# EasyEDA Pro project PCB.eprj

# Schematic Schematic1
Board Name: Board1; Create Date: 2026-05-25; Page Name: P1; Project Name: PCB; Schematic Name: Schematic1; Update Date: 2026-05-27; Company: EasyEDA.com; Page Size: A4; Version: V1.0
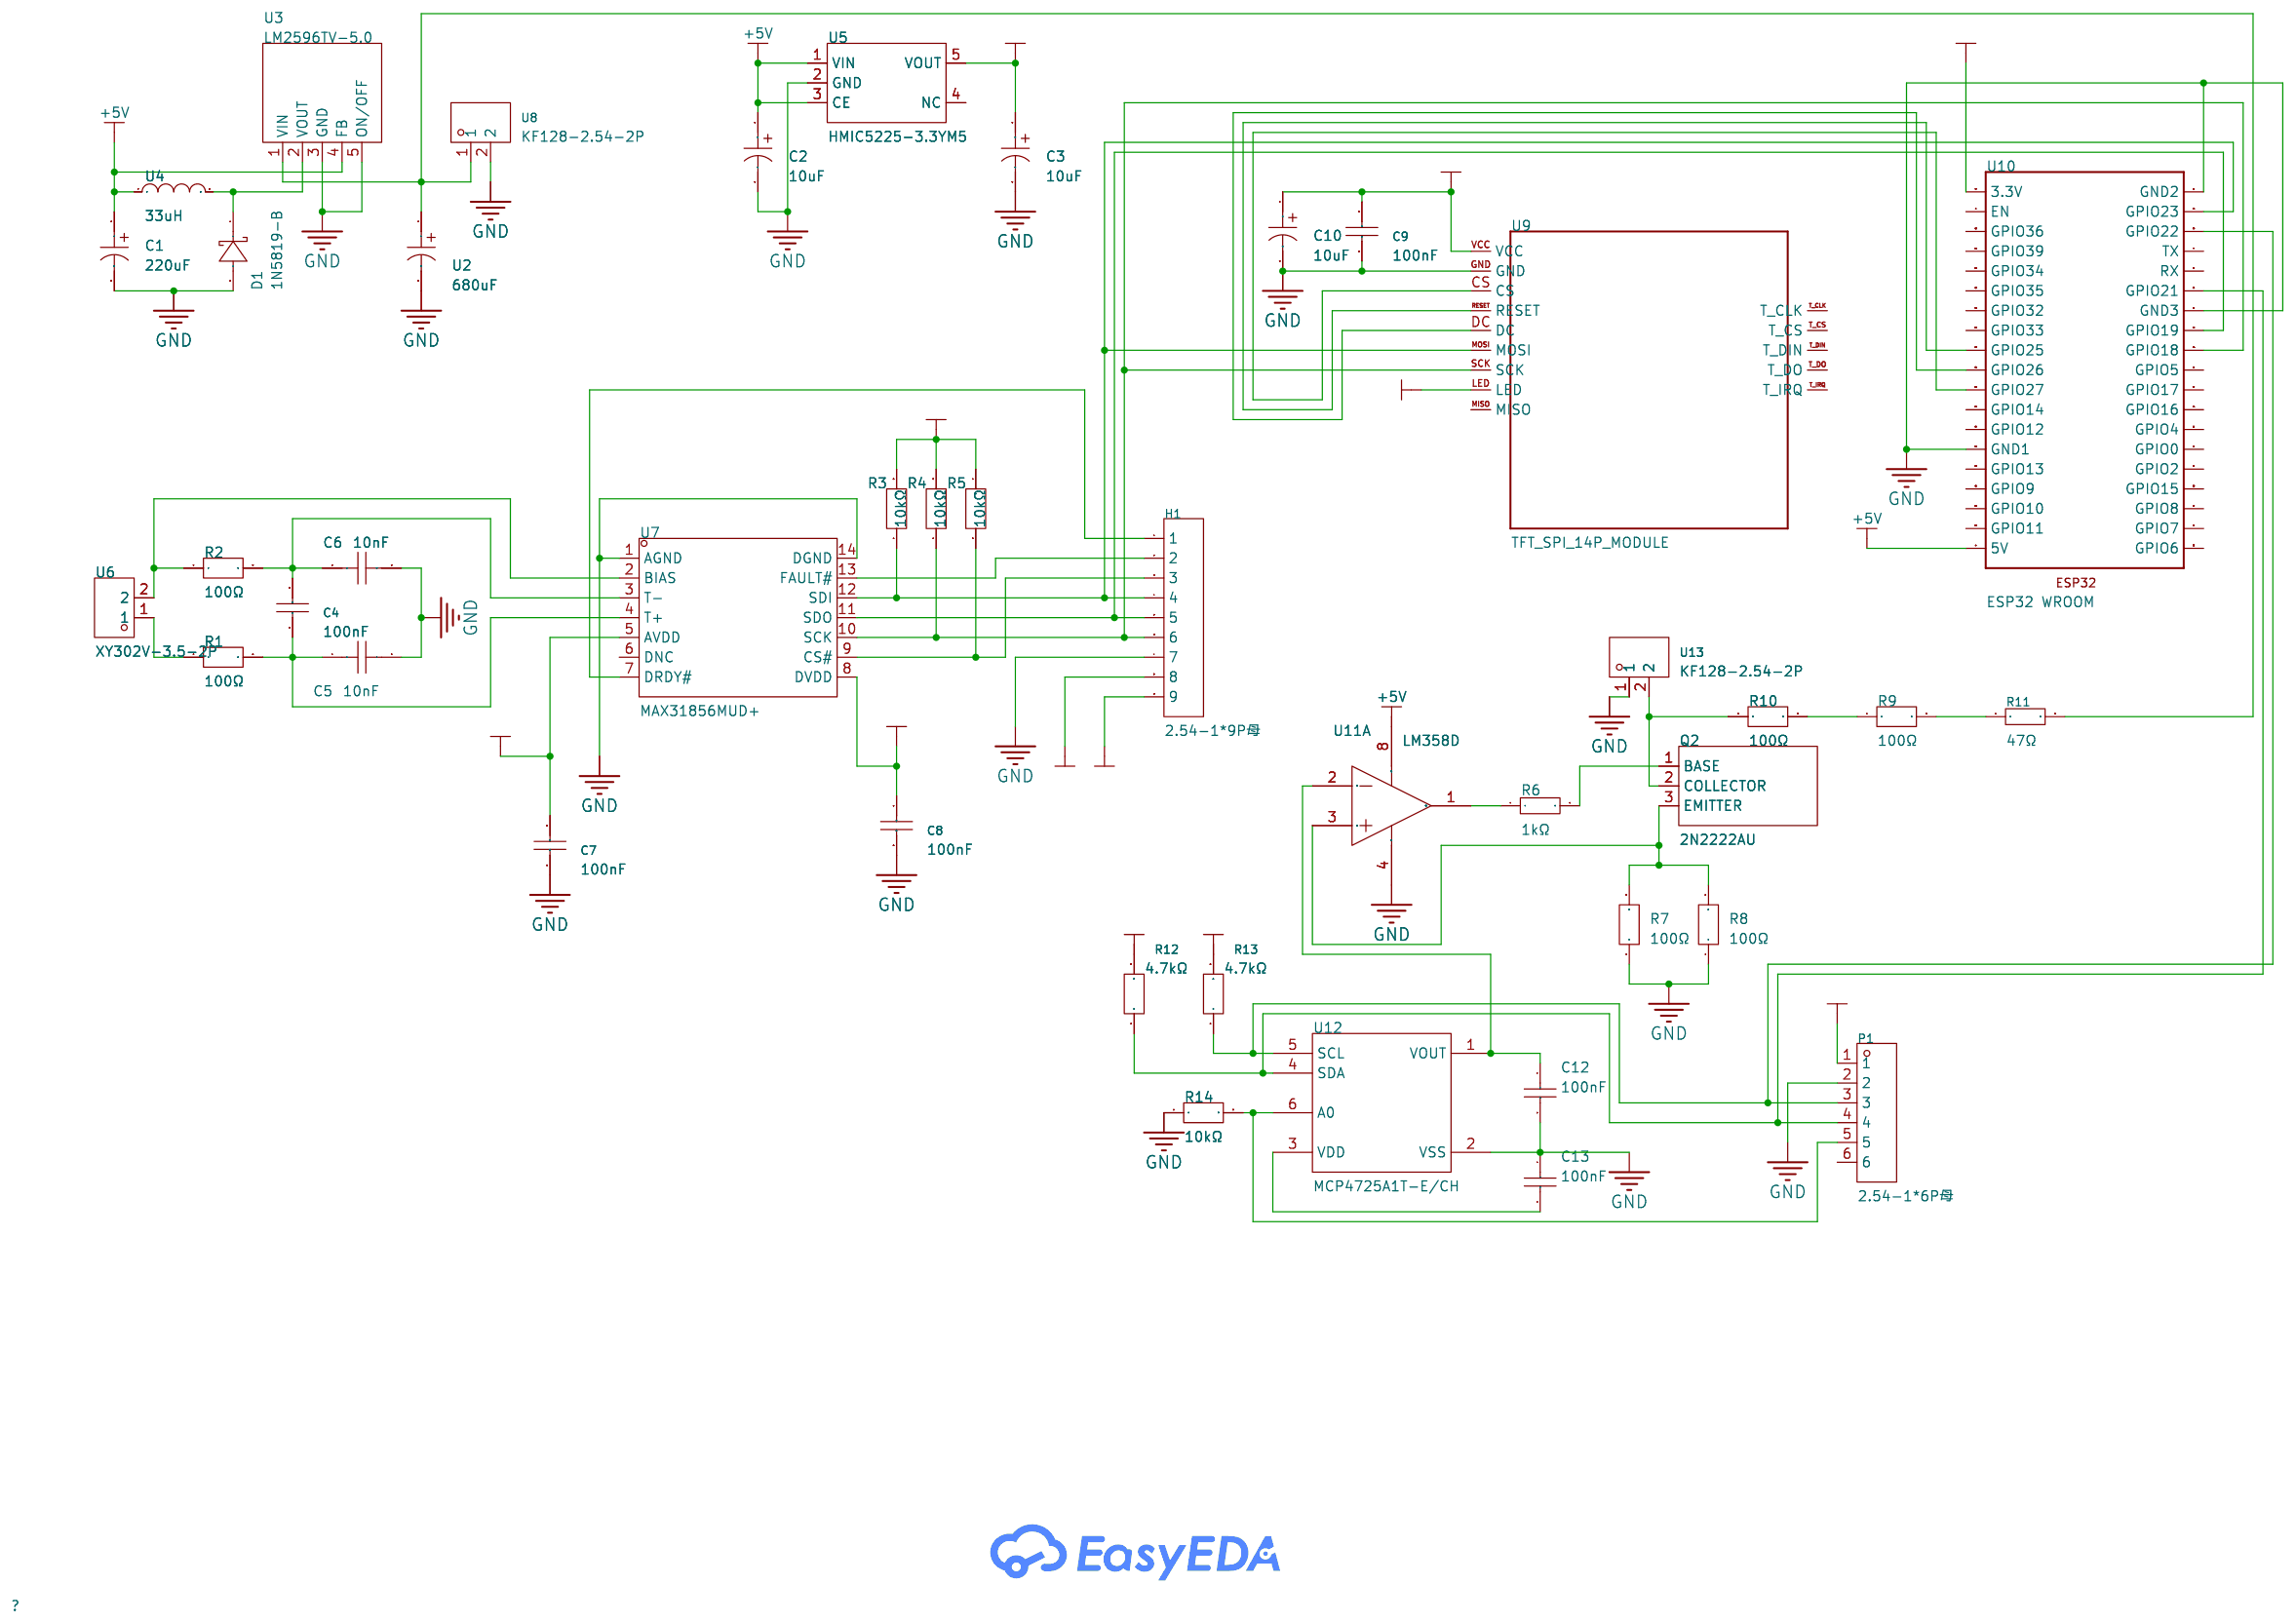
[diagram p0: schematic sheet]

## Parts
C1  220uF  [CAP-TH_BD10.0-P5.00-D1.0-FD]
C2  10uF  [CAP-TH_BD5.0-P2.00-D0.8-FD-10UF50VC110GL]
C3  10uF  [CAP-TH_BD5.0-P2.00-D0.8-FD-10UF50VC110GL]
C4  100nF  [C0805]
C5  10nF  [C0402]
C6  10nF  [C0402]
C7  100nF  [C0805]
C8  100nF  [C0805]
C9  100nF  [C0805]
C10  10uF  [CAP-TH_BD5.0-P2.00-D0.8-FD-10UF50VC110GL]
C12  100nF  [C0402]
C13  100nF  [C0402]
D1  1N5819-B  [DO-41_BD2.4-L4.7-P8.70-D0.6-RD]
H1  2.54-1*9P母  [HDR-TH_9P-P2.54-V-F-1]
P1  2.54-1*6P母  [HDR-TH_6P-P2.54-V-F]
Q2  2N2222AU  [SOT-89-3_L4.5-W2.4-P1.50-LS4.0-BR]
R1  100Ω  [R0603]
R2  100Ω  [R0603]
R3  10kΩ  [R0805]
R4  10kΩ  [R0805]
R5  10kΩ  [R0805]
R6  1kΩ  [R0402]
R7  100Ω  [R0603]
R8  100Ω  [R0603]
R9  100Ω  [R0603]
R10  100Ω  [R0603]
R11  47Ω  [R0603]
R12  4.7kΩ  [R0603]
R13  4.7kΩ  [R0603]
R14  10kΩ  [R0805]
U2  680uF  [CAP-TH_BD13.0-P5.00-D0.6-FD]
U3  LM2596TV-5.0  [TO-220-5_L10.2-W4.5-P1.70-TL]
U4  33uH  [IND-TH_L7.0-W4.0-P5.0]
U5  HMIC5225-3.3YM5  [SOT-23-5_L3.0-W1.7-P0.95-LS2.8-BL]
U6  XY302V-3.5-2P  [CONN-TH_XY302V-3.5-2P]
U7  MAX31856MUD+  [TSSOP-14_L5.0-W4.4-P0.65-LS6.4-BL]
U8  KF128-2.54-2P  [CONN-TH_P2.54_KF128-2.54-2P]
U9  TFT_SPI_14P_MODULE  [TFT_2_4_SPI_MODULE]
U10  ESP32 WROOM  [ESP32]
U11  LM358D  [SO-8_L4.9-W3.9-P1.27-LS5.9-BL]  (section 1)
U12  MCP4725A1T-E/CH  [SOT-23-6_L2.9-W1.6-P0.95-LS2.8-BR]
U13  KF128-2.54-2P  [CONN-TH_P2.54_KF128-2.54-2P]

## Library data of the parts
C1 = 220uF50V10x13GF: LCSC Part Name: 220uF ±20% 50V; Supplier Part: C49332873; Manufacturer: Econd(米朗电子); Supplier Footprint: 插件,D10xL13mm; JLCPCB Part Class: Extended Part; Datasheet: https://item.szlcsc.com/datasheet/220uF50V10x13GF/51816589.html; Supplier: LCSC; Tolerance: ±20%; Voltage Rating: 50V; Ripple Current: 850mA@100KHz; Equivalent Series Resistance(ESR): 65mΩ; Pin Spacing: 5mm; Diameter: 10mm; Height - Seated (Max): 13mm; Lifetime: 2000hrs@105℃; Operating Temperature: -40℃~+105℃
C2 C3 C10 = 10UF50VC110GL: LCSC Part Name: 10uF ±20% 50V; Supplier Part: C46867109; Manufacturer: Econd(米朗电子); Supplier Footprint: 插件,D5xL11mm; JLCPCB Part Class: Extended Part; Datasheet: https://item.szlcsc.com/datasheet/10UF50VC110GL/49031974.html; Supplier: LCSC; Tolerance: ±20%; Voltage Rating: 50V; Ripple Current: 120mA@100KHz; Equivalent Series Resistance(ESR): 1.6Ω; Pin Spacing: 2mm; Diameter: 5mm; Height - Seated (Max): 11mm; Lifetime: 5000hrs@105℃; Operating Temperature: -40℃~+105℃
C4 C7-C9 = 0805B104K500NT: LCSC Part Name: 100nF ±10% 50V; Supplier Part: C38141; Manufacturer: FH(风华); Supplier Footprint: 0805; JLCPCB Part Class: Extended Part; Datasheet: https://item.szlcsc.com/datasheet/0805B104K500NT/39123.html; Supplier: LCSC; Tolerance: ±10%; Voltage Rating: 50V; Temperature Coefficient: X7R
C5 C6 = FCC0402B103K500AT: LCSC Part Name: 10nF ±10% 50V; Supplier Part: C5137480; Manufacturer: FOJAN(富捷); Supplier Footprint: 0402; JLCPCB Part Class: Extended Part; Datasheet: https://item.szlcsc.com/datasheet/FCC0402B103K500AT/5746982.html; Supplier: LCSC; Tolerance: ±10%; Voltage Rating: 50V; Temperature Coefficient: X7R
C12 C13 = 0402B104K500NT: LCSC Part Name: 100nF ±10% 50V; Supplier Part: C110251; Manufacturer: FH(风华); Supplier Footprint: 0402; JLCPCB Part Class: Extended Part; Datasheet: https://item.szlcsc.com/datasheet/0402B104K500NT/111473.html; Supplier: LCSC; Tolerance: ±10%; Voltage Rating: 50V; Temperature Coefficient: X7R
D1 = 1N5819-B: LCSC Part Name: 电压:40V 电流:1A; Supplier Part: C908715; Manufacturer: GOODWORK(固得沃克); Supplier Footprint: DO-41; JLCPCB Part Class: Extended Part; Datasheet: https://item.szlcsc.com/datasheet/1N5819-B/975467.html; Supplier: LCSC; Diode Configuration: Independent; Voltage - Forward(Vf@If): 600mV@1A; Voltage - DC Reverse(Vr): 40V; Current - Rectified: 1A; Reverse Leakage Current (Ir): 200uA@40V; Operating Junction Temperature Range: -65℃~+125℃; Non-Repetitive Peak Forward Surge Current: 25A
H1 = 2.54-1*9P母: LCSC Part Name: 1x9P 间距:2.54mm 直插; Supplier Part: C39576; Manufacturer: BOOMELE(博穆精密); Supplier Footprint: 插件,P=2.54mm; JLCPCB Part Class: Extended Part; Datasheet: https://item.szlcsc.com/datasheet/2.54-1*9P%25E6%25AF%258D/40559.html; Supplier: LCSC; Holes Structure: 1x9P; Pitch: 2.54mm; Circular Hole / Square Hole: Square Hole; Mounting Type: Through Hole; Number of Rows: 1; Number of Positions: 9P; Current Rating: 3A; Holes Direction: Top; Contact Material: Brass; Operating Temperature: -40℃~+105℃; PIN Length: 3.3mm
P1 = 2.54-1*6P母: LCSC Part Name: 1x6P 间距:2.54mm 直插; Supplier Part: C40877; Manufacturer: BOOMELE(博穆精密); Supplier Footprint: 插件,P=2.54mm; JLCPCB Part Class: Extended Part; Datasheet: https://item.szlcsc.com/datasheet/2.54-1*6P%25E6%25AF%258D/41861.html; Supplier: LCSC; Holes Structure: 1x6P; Pitch: 2.54mm; Circular Hole / Square Hole: Square Hole; Mounting Type: Through Hole; Number of Rows: 1; Number of Positions: 6P; Current Rating: 3A; Holes Direction: Top; Contact Material: Brass; Operating Temperature: -40℃~+105℃; PIN Length: 3.3mm
Q2 = 2N2222AU: LCSC Part Name: NPN 电流:600mA 电压:40V; Supplier Part: C21714170; Manufacturer: CBI(创基); Supplier Footprint: SOT-89; JLCPCB Part Class: Extended Part; Datasheet: https://item.szlcsc.com/datasheet/2N2222AU/23141081.html; Supplier: LCSC; type: NPN; Current - Collector(Ic): 600mA; Collector - Emitter Voltage VCEO: 40V; Pd - Power Dissipation: 500mW; DC Current Gain: 300@150mA,10V; Transition frequency(fT): 300MHz; Current - Collector Cutoff: 10nA; Vce Saturation(VCE(sat)): 1V@500mA,50mA; Operating Temperature: -55℃~+150℃; Emitter-Base Voltage(Vebo): 6V; Number: 1 NPN
R1 R2 R7-R10 = FRC0603F1000TS: LCSC Part Name: 100Ω ±1% 100mW 厚膜电阻; Supplier Part: C2906981; Manufacturer: FOJAN(富捷); Supplier Footprint: 0603; JLCPCB Part Class: Extended Part; Supplier: LCSC; Type: Thick Film Resistor; Tolerance: ±1%; Power(Watts): 100mW; Voltage-Supply(Max): 75V; Temperature Coefficient: ±100ppm/℃; Operating Temperature: -55℃~+155℃
R3-R5 R14 = FRC0805J103TS: LCSC Part Name: 10kΩ ±5% 125mW 厚膜电阻; Supplier Part: C2930231; Manufacturer: FOJAN(富捷); Supplier Footprint: 0805; JLCPCB Part Class: Extended Part; Supplier: LCSC; Type: Thick Film Resistor; Tolerance: ±5%; Power(Watts): 125mW; Voltage-Supply(Max): 150V; Temperature Coefficient: ±100ppm/℃; Operating Temperature: -55℃~+155℃
R6 = RC0402FR-071KL: LCSC Part Name: 厚膜电阻 1kΩ ±1% 62.5mW; Supplier Part: C106235; Manufacturer: YAGEO(国巨); Supplier Footprint: 0402; JLCPCB Part Class: Extended Part; Datasheet: https://item.szlcsc.com/datasheet/RC0402FR-071KL/107450.html; Supplier: LCSC; Type: Thick Film Resistor; Tolerance: ±1%; Power(Watts): 62.5mW; Voltage-Supply(Max): 50V; Temperature Coefficient: ±100ppm/℃; Operating Temperature: -55℃~+155℃
R11 = 0603WAF470JT5E: LCSC Part Name: 47Ω ±1% 100mW 厚膜电阻; Supplier Part: C23182; Manufacturer: UNI-ROYAL(厚声); Supplier Footprint: 0603; JLCPCB Part Class: Basic Part; Datasheet: https://item.szlcsc.com/datasheet/0603WAF470JT5E/23909.html; Supplier: LCSC; Type: Thick Film Resistor; Tolerance: ±1%; Power(Watts): 100mW; Voltage-Supply(Max): 75V; Temperature Coefficient: ±100ppm/℃; Operating Temperature: -55℃~+155℃
R12 R13 = FRC0603J472 TS: LCSC Part Name: 4.7kΩ ±5% 100mW 厚膜电阻; Supplier Part: C2907166; Manufacturer: FOJAN(富捷); Supplier Footprint: 0603; JLCPCB Part Class: Extended Part; Supplier: LCSC; Type: Thick Film Resistor; Tolerance: ±5%; Power(Watts): 100mW; Voltage-Supply(Max): 75V; Temperature Coefficient: ±100ppm/℃; Operating Temperature: -55℃~+155℃
U2 = SHF680UF50V03EC1055: LCSC Part Name: 680uF ±20% 50V; Supplier Part: C2981468; Manufacturer: KNSCHA(科尼盛); Supplier Footprint: 插件,D13xL17mm; JLCPCB Part Class: Extended Part; Datasheet: https://item.szlcsc.com/datasheet/SHF680UF50V03EC1055/3408690.html; Supplier: LCSC; Tolerance: ±20%; Voltage Rating: 50V; Ripple Current: 1.1A@100kHz; Equivalent Series Resistance(ESR): 55mΩ@100kHz; Pin Spacing: 5mm; Diameter: 13mm; Height - Seated (Max): 17mm; Lifetime: 5000hrs@105℃; Operating Temperature: -40℃~+105℃
U3 = LM2596TV-5.0: LCSC Part Name: 降压型 3A 40V; Supplier Part: C32381516; Manufacturer: HTC; Supplier Footprint: TO-220TV-5L; JLCPCB Part Class: Extended Part; Datasheet: https://item.szlcsc.com/datasheet/LM2596TV-5.0/34114759.html; Supplier: LCSC; Function: Buck; Voltage - Supply: 40V; Output Voltage: 5V; Output Current: 3A; Frequency - Switching: 150kHz; Operating Temperature: -40℃~+125℃; Synchronous Rectifier: No; Number of Outputs: 1; Topology: Buck; Quiescent Current: 5mA; Switch tube (built-in/external): Built-in; Output Type: Fixed
U4 = 2727-07H: LCSC Part Name: 33uH ±3%; Supplier Part: C17574802; Manufacturer: API Delevan; Supplier Footprint: 插件,7.1x4.1mm; JLCPCB Part Class: Extended Part; Supplier: LCSC; Tolerance: ±3%
U5 = HMIC5225-3.3YM5: LCSC Part Name: IO:0.15A VO:3.3V VI:18V; Supplier Part: C22392690; Manufacturer: HXY MOSFET(华轩阳电子); Supplier Footprint: SOT-23-5L; JLCPCB Part Class: Extended Part; Datasheet: https://item.szlcsc.com/datasheet/HMIC5225-3.3YM5/23981531.html; Supplier: LCSC; Output Type: Fixed; Voltage - Supply: 16V; Output Voltage: 3.3V; Output Current: 150mA; Voltage Dropout: 25mV@(1mA); standby current: 5uA; Features: Enable；Over Current Protection；Over Temperature Protection; Operating Temperature: -30℃~+85℃@(Ta); Output Configuration: Positive; Number of Outputs: 1
U6 = XY302V-3.5-2P: LCSC Part Name: 1x2P 3.5mm 直插 排数:1 每排P数:2; Supplier Part: C784940; Manufacturer: XINLAIYA(新莱亚); Supplier Footprint: 插件,P=3.5mm; JLCPCB Part Class: Extended Part; Datasheet: https://atta.szlcsc.com/upload/public/pdf/source/20200917/C784940_49AA76C88E0E78B736F07A335BB5A9B8.pdf; Supplier: LCSC; Structure: 1x2P; Pitch: 3.5mm; Color: Green; Mounting Style: Straight; Current Rating (Max): 10A; Voltage Rating (Max): 150V; Number of Pins: 2P; Number of Rows: 1; Wire Gauge - AWG: 16~26; Wire Gauge - mm2: 1; Number of PINs Per Row: 2; Contact Material: Copper; Contact Plating: Tin; Screw Specification: M2
U7 = MAX31856MUD+: LCSC Part Name: MAX31856MUD; Supplier Part: C116632; Manufacturer: ADI(亚德诺)/MAXIM(美信); Supplier Footprint: TSSOP-14; JLCPCB Part Class: Extended Part; Datasheet: https://atta.szlcsc.com/upload/public/pdf/source/20180413/C116632_831D9B1C9ECFD227FC0EF5729DAE9663.pdf; Supplier: LCSC
U8 U13 = KF128-2.54-2P: LCSC Part Name: 2.54mm 1x2P 排数:1 每排P数:2 直插; Supplier Part: C474920; Manufacturer: KEFA(科发); Supplier Footprint: 插件,P=2.54mm; JLCPCB Part Class: Extended Part; Datasheet: https://atta.szlcsc.com/upload/public/pdf/source/20230317/0E5ECA9DB49110BC3219D12632CEA6EE.pdf; Supplier: LCSC; Structure: 1x2P; Pitch: 2.54mm; Color: Green; Mounting Style: Straight; Current Rating (Max): 8A; Voltage Rating (Max): 130V; Number of Pins: 2P; Number of Rows: 1; Wire Gauge - AWG: 18~26; Wire Gauge - mm2: 1; Number of PINs Per Row: 2; Operating Temperature Range: -40℃~+105℃
U9 = TFT_SPI_14P_MODULE
U10 = ESP32
U11 = LM358D: LCSC Part Name: 低功耗双运算放大器，低输入偏置电流; Supplier Part: C2936099; Manufacturer: ST(意法半导体); Supplier Footprint: SO-8; JLCPCB Part Class: Extended Part; Datasheet: https://item.szlcsc.com/datasheet/LM358D/3287847.html; Supplier: LCSC; Number of Channels: 2; Maximum Power Supply Range (Vdd-Vss): 32V; Gain Bandwidth Product: 1.1MHz; Vos - Input Offset Voltage: 7mV; Input Offset Voltage Drift(Vos TC): 30uV/℃; Slew Rate: 600V/ms; Ib - Input Bias Current: 200nA; Input Offset Current(Ios): 30nA; Noise density(eN): 55nV/√Hz@1kHz; Common Mode Rejection Ratio(CMRR): 85dB; Input offset current drift(Ios TC): 300pA/℃; Quiescent Current: 1.2mA; Operating Temperature: 0℃~+70℃; Single supply: 3V~30V
U12 = MCP4725A1T-E/CH: LCSC Part Name: 12-位数字到模拟转换器带EEPROM内存，采用SOT-23-6封装; Supplier Part: C61423; Manufacturer: MICROCHIP(美国微芯); Supplier Footprint: SOT-23-6; JLCPCB Part Class: Extended Part; Datasheet: https://item.szlcsc.com/datasheet/MCP4725A1T-E%252FCH/62476.html; Supplier: LCSC; Resolution(Bits): 12; Number of Channels: 1; Interface: I2C; Voltage - Supply: 2.7V~5.5V; Settling Time: 6us; Output Type: Voltage Buffer; Integral non - linearity: 2LSB; Operating Temperature: -40℃~+125℃; Power-On Reset: Built-in; Voltage Reference: External; Data rate: 3.4MHz；100kHz；400kHz; Quiescent Current (Iq): 60nA

## Nets
+3.3V: C3.1 C7.1 C8.1 C9.1 C10.1 H1.8 P1.1 R3.2 R4.2 R5.1 R12.2 R13.2 U5.5(VOUT) U7.5(AVDD) U7.8(DVDD) U9.LED U9.VCC U10.3.3V
+5V: C1.1 C2.1 U3.4(FB) U4.1 U5.1(VIN) U5.3(CE) U10.5V U11.8(VCC+)
GND: C1.2 C2.2 C3.2 C5.2 C6.2 C7.2 C8.2 C9.2 C10.2 C12.2 C13.1 D1.2(A) H1.7 P1.2 R7.1 R8.1 R14.1 U2.2 U3.3(GND) U3.5(ON/OFF) U5.2(GND) U7.1(AGND) U7.14(DGND) U8.2 U9.GND U10.GND1 U10.GND2 U10.GND3 U11.4(VCC-) U12.2(VSS) U13.1
VIN: H1.9
$1N404: R11.2 U2.1 U3.1(VIN) U8.1
$1N698: D1.1(K) U3.2(VOUT) U4.2
$1N1786: R2.1 U6.2 U7.2(BIAS)
$1N1792: C4.1 C5.1 R1.2 U7.4(T+)
$1N2031: C4.2 C6.1 R2.2 U7.3(T-)
$1N3106: H1.2 U7.13(FAULT#)
$1N3112: H1.4 R3.1 U7.12(SDI) U9.MOSI U10.GPIO23
$1N3116: H1.5 U7.11(SDO) U10.GPIO19
$1N3121: H1.6 R4.1 U7.10(SCK) U9.SCK U10.GPIO18
$1N3126: H1.3 R5.2 U7.9(CS#)
$1N5751: U9.CS U10.GPIO27
$1N5766: U9.RESET U10.GPIO25
$1N5777: U9.DC U10.GPIO26
$1N6508: R6.1 U11.1(OUT1)
$1N6563: Q2.3(EMITTER) R7.2 R8.2 U11.3(IN1+)
$1N6609: Q2.2(COLLECTOR) R10.1 U13.2
$1N6614: R9.1 R10.2
$1N6619: R9.2 R11.1
$1N7236: P1.3 R13.1 U10.GPIO22 U12.5(SCL)
$1N7241: P1.4 R12.1 U10.GPIO21 U12.4(SDA)
$1N7320: P1.5 R14.2 U12.6(A0)
$1N7324: C13.2 U12.3(VDD)
$1N7489: C12.1 U11.2(IN1-) U12.1(VOUT)
$1N7539: H1.1 U7.7(DRDY#)
$1N8835: R1.1 U6.1
$1N10153: Q2.1(BASE) R6.2

Not connected (* = marked no-connect by the designer): P1 6; U5 4(NC); U7 6(DNC); U9 MISO T_CLK T_CS T_DIN T_DO T_IRQ; U10 EN GPIO0 GPIO2 GPIO4 GPIO5 GPIO6 GPIO7 GPIO8 GPIO9 GPIO10 GPIO11 GPIO12 GPIO13 GPIO14 GPIO15 GPIO16 GPIO17 GPIO32 GPIO33 GPIO34 GPIO35 GPIO36 GPIO39 RX TX

# Board PCB1
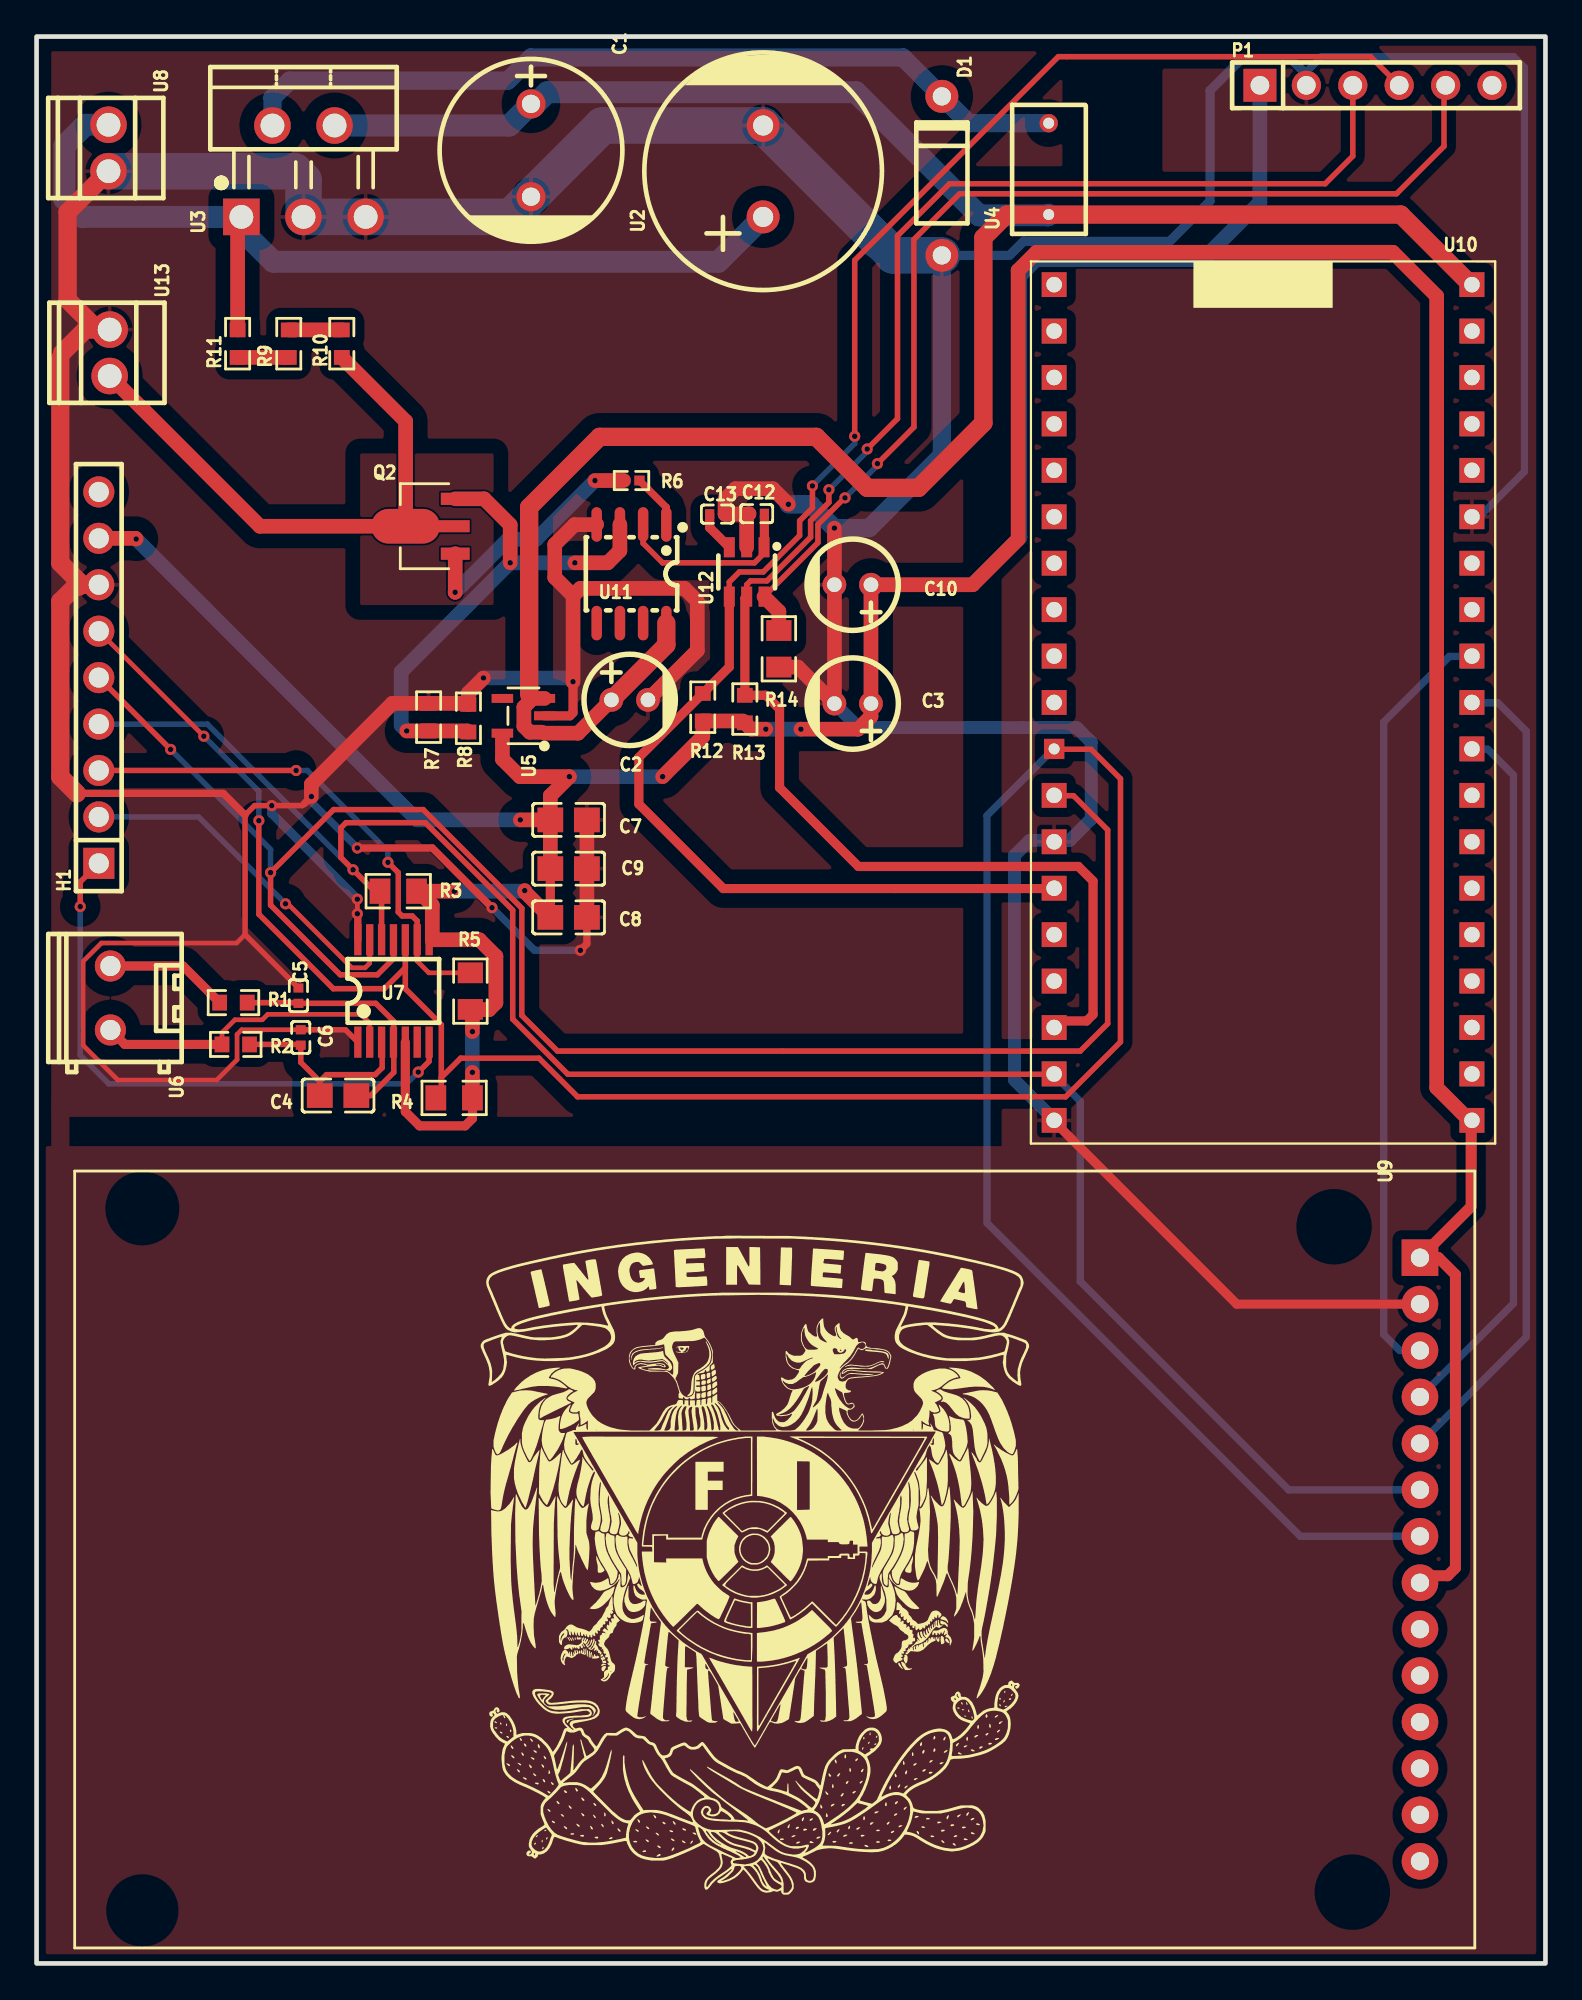
[diagram p1: board, top side]
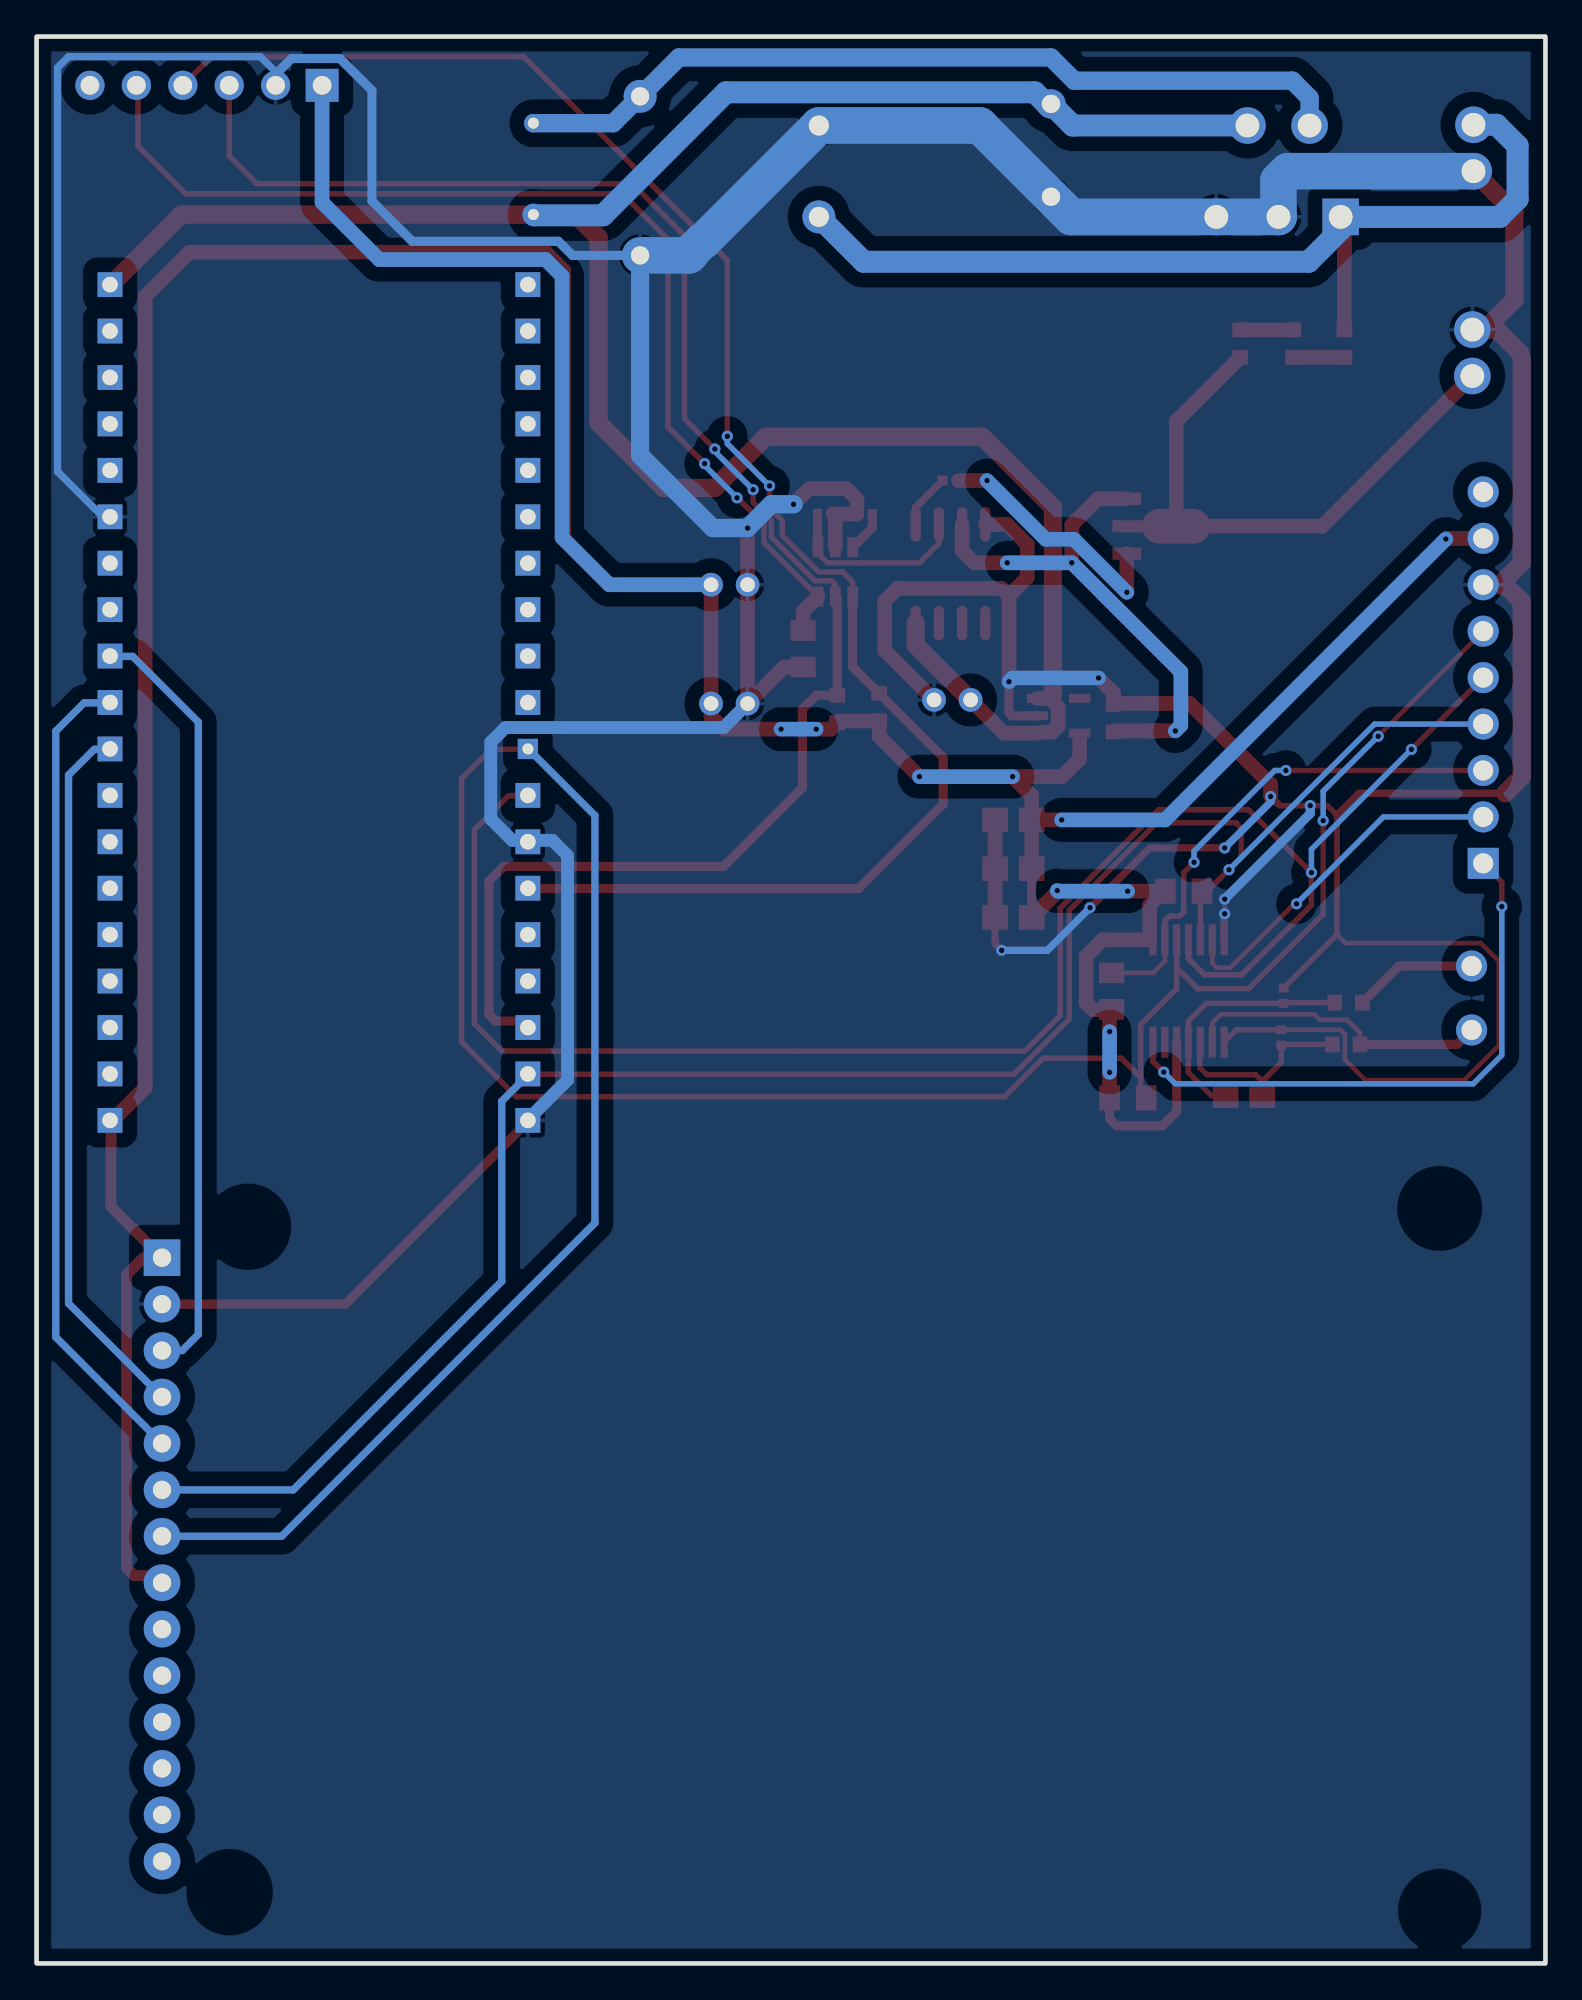
[diagram p2: board, bottom side, seen from below]

Outline 82.55 x 105.41 mm; copper layers: Top Layer, Bottom Layer. Coordinates in mm from the lower left corner of the outline.
Outline path: rectangle 0,105.41 82.55,0
Stack: Top Layer 0.035mm / Dielectric1 1.51mm FR4 er 4.5 / Bottom Layer 0.035mm

## Design rules (mm)
template: Custom Config
spacing copperThickness1oz (default): track to track 0.102, other pairs 0.152 to 0.3
spacing copperThickness2oz: track to track 0.203, other pairs 0.152 to 0.3
track width copperThickness1oz (default): min 0.127, default 0.254, max 2.54
track width copperThickness2oz: min 0.203, default 0.254, max 2.54
differential pair differentialPair (default): width min 0.127, default 0.254, max 2.54; gap min 0.152, default 0.152
via viaSize (default): diameter min 0.5, default 0.61, max 10; hole min 0.3, default 0.305, max 6.3
net GND uses copperRegion1
net $1N6609 uses copperRegion1

## Placement (name value [footprint] x y rotation side)
C1  220uF  [CAP-TH_BD10.0-P5.00-D1.0-FD]  27.05 99.19 270 top
C2  10uF  [CAP-TH_BD5.0-P2.00-D0.8-FD-10UF50VC110GL]  32.45 69.12 0 top
C3  10uF  [CAP-TH_BD5.0-P2.00-D0.8-FD-10UF50VC110GL]  44.65 68.92 180 top
C4  100nF  [C0805]  16.49 47.48 180 top
C5  10nF  [C0402]  14.33 52.94 90 top
C6  10nF  [C0402]  14.45 50.66 90 top
C7  100nF  [C0805]  29.11 62.56 0 top
C8  100nF  [C0805]  29.11 57.22 0 top
C9  100nF  [C0805]  29.11 59.89 0 top
C10  10uF  [CAP-TH_BD5.0-P2.00-D0.8-FD-10UF50VC110GL]  44.65 75.42 180 top
C12  100nF  [C0402]  39.4 79.31 180 top
C13  100nF  [C0402]  37.25 79.29 180 top
D1  1N5819-B  [DO-41_BD2.4-L4.7-P8.70-D0.6-RD]  49.53 97.79 270 top
H1  2.54-1*9P母  [HDR-TH_9P-P2.54-V-F-1]  3.41 70.34 90 top
P1  2.54-1*6P母  [HDR-TH_6P-P2.54-V-F]  73.28 102.74 0 top
Q2  2N2222AU  [SOT-89-3_L4.5-W2.4-P1.50-LS4.0-BR]  21.55 78.62 0 top
R1  100Ω  [R0603]  10.77 52.56 0 top
R2  100Ω  [R0603]  10.9 50.27 0 top
R3  10kΩ  [R0805]  19.79 58.66 0 top
R4  10kΩ  [R0805]  22.84 47.35 0 top
R5  10kΩ  [R0805]  23.73 53.19 90 top
R6  1kΩ  [R0402]  32.55 81.12 180 top
R7  100Ω  [R0603]  21.45 68.18 270 top
R8  100Ω  [R0603]  23.63 68.12 270 top
R9  100Ω  [R0603]  13.8 88.61 270 top
R10  100Ω  [R0603]  16.7 88.61 90 top
R11  47Ω  [R0603]  11 88.61 90 top
R12  4.7kΩ  [R0603]  36.45 68.72 270 top
R13  4.7kΩ  [R0603]  38.75 68.62 270 top
R14  10kΩ  [R0805]  40.61 71.92 90 top
U2  680uF  [CAP-TH_BD13.0-P5.00-D0.6-FD]  39.75 98.04 90 top
U3  LM2596TV-5.0  [TO-220-5_L10.2-W4.5-P1.70-TL]  14.61 98.04 90 top
U4  33uH  [IND-TH_L7.0-W4.0-P5.0]  55.37 98.17 90 top
U5  HMIC5225-3.3YM5  [SOT-23-5_L3.0-W1.7-P0.95-LS2.8-BL]  26.64 68.25 90 top
U6  XY302V-3.5-2P  [CONN-TH_XY302V-3.5-2P]  4.04 52.81 270 top
U7  MAX31856MUD+  [TSSOP-14_L5.0-W4.4-P0.65-LS6.4-BL]  19.53 53.2 0 top
U8  KF128-2.54-2P  [CONN-TH_P2.54_KF128-2.54-2P]  3.94 99.31 270 top
U9  TFT_SPI_14P_MODULE  [TFT_2_4_SPI_MODULE]  40.39 22.1 270 top
U10  ESP32 WROOM  [ESP32]  79.8 93.11 180 top
U11  LM358D  [SO-8_L4.9-W3.9-P1.27-LS5.9-BL]  32.55 76.02 180 top
U12  MCP4725A1T-E/CH  [SOT-23-6_L2.9-W1.6-P0.95-LS2.8-BR]  38.85 76.12 90 top
U13  KF128-2.54-2P  [CONN-TH_P2.54_KF128-2.54-2P]  4 88.11 270 top

## Footprints (pads in the part's own frame, mm; a bottom-side part is the same pattern mirrored in y, then rotated)
C0402
  rect 0.5x0.54 smd: 1(-0.42,0) 2(0.42,0)
C0805
  rect 1.41x1.35 smd: 1(-1,0) 2(1,0)
CAP-TH_BD5.0-P2.00-D0.8-FD-10UF50VC110GL
  round 1.3 hole 0.8: 1(-1,0) 2(1,0)
CAP-TH_BD10.0-P5.00-D1.0-FD
  round 1.6 hole 1: 1(-2.54,0) 2(2.54,0)
CAP-TH_BD13.0-P5.00-D0.6-FD
  round 1.8 hole 1.1: 1(-2.5,0) 2(2.5,0)
CONN-TH_P2.54_KF128-2.54-2P
  round 2 hole 1.3: 1(-1.27,0) 2(1.27,0)
CONN-TH_XY302V-3.5-2P
  round 1.7 hole 1.1: 1(-1.75,0) 2(1.75,0)
DO-41_BD2.4-L4.7-P8.70-D0.6-RD
  round 1.8 hole 1: 1(-4.35,0) 2(4.35,0)
ESP32
  rect 1.358x1.358 hole 0.85: 3.3V(1.27,46.99) 5V(1.27,1.27) EN(1.27,44.45) GND1(1.27,13.97) GND2(24.13,46.99) GND3(24.13,31.75) GPIO0(24.13,13.97) GPIO2(24.13,11.43) GPIO4(24.13,16.51) GPIO5(24.13,24.13) GPIO6(24.13,1.27) GPIO7(24.13,3.81) GPIO8(24.13,6.35) GPIO9(1.27,8.89) GPIO10(1.27,6.35) GPIO11(1.27,3.81) GPIO12(1.27,16.51) GPIO13(1.27,11.43) GPIO14(1.27,19.05) GPIO15(24.13,8.89) GPIO16(24.13,19.05) GPIO17(24.13,21.59) GPIO19(24.13,29.21) GPIO21(24.13,34.29) GPIO22(24.13,41.91) GPIO23(24.13,44.45) GPIO25(1.27,26.67) GPIO26(1.27,24.13) GPIO27(1.27,21.59) GPIO32(1.27,31.75) GPIO33(1.27,29.21) GPIO34(1.27,36.83) GPIO35(1.27,34.29) GPIO36(1.27,41.91) GPIO39(1.27,39.37) RX(24.13,36.83) TX(24.13,39.37)
  rect 1.108x1.108 hole 0.6: GPIO18(24.13,26.67)
HDR-TH_6P-P2.54-V-F
  rect 1.8x1.8 hole 1.02: 1(-6.35,0)
  round 1.6 hole 1.02: 2(-3.81,0) 3(-1.27,0) 4(1.27,0) 5(3.81,0) 6(6.35,0)
HDR-TH_9P-P2.54-V-F-1
  rect 1.7x1.7 hole 1.1: 1(-10.16,0)
  round 1.7 hole 1.1: 2(-7.62,0) 3(-5.08,0) 4(-2.54,0) 5(0,0) 6(2.54,0) 7(5.08,0) 8(7.62,0) 9(10.16,0)
IND-TH_L7.0-W4.0-P5.0
  round 1 hole 0.6: 1(-2.5,0) 2(2.5,0)
R0402
  rect 0.566x0.54 smd: 1(-0.433,0) 2(0.433,0)
R0603
  rect 0.806x0.864 smd: 1(-0.753,0) 2(0.753,0)
R0805
  rect 1.133x1.377 smd: 1(-1,0) 2(1,0)
SO-8_L4.9-W3.9-P1.27-LS5.9-BL
  oval 0.574x1.888 smd: 1(-1.905,-2.699) 2(-0.635,-2.699) 3(0.635,-2.699) 4(1.905,-2.699) 5(1.905,2.699) 6(0.635,2.699) 7(-0.635,2.699) 8(-1.905,2.699)
SOT-23-5_L3.0-W1.7-P0.95-LS2.8-BL
  rect 0.49x1.157 smd: 1(-0.95,-1.153) 2(0,-1.153) 3(0.95,-1.153)
  rect 0.49x1.175 smd: 4(0.95,1.153) 5(-0.95,1.153)
SOT-23-6_L2.9-W1.6-P0.95-LS2.8-BR
  rect 1.1x0.6 smd: 1(1.35,-0.95) 2(1.35,0) 3(1.35,0.95) 4(-1.35,0.95) 5(-1.35,0) 6(-1.35,-0.95)
SOT-89-3_L4.5-W2.4-P1.50-LS4.0-BR
  rect 1.575x0.672 smd: 1(1.357,-1.5) 3(1.357,1.5)
  custom 5.377x1.9 smd: 2(-1.357,-0.001)
TFT_2_4_SPI_MODULE
  round 2 hole 1: CS(-11.43,35.3) DC(-6.35,35.3) GND(-13.97,35.3) LED(1.27,35.3) MISO(3.81,35.3) MOSI(-3.81,35.3) RESET(-8.89,35.3) SCK(-1.27,35.3) T_CLK(6.35,35.3) T_CS(8.89,35.3) T_DIN(11.43,35.3) T_DO(13.97,35.3) T_IRQ(16.51,35.3)
  rect 2x2 hole 1: VCC(-16.51,35.3)
TO-220-5_L10.2-W4.5-P1.70-TL
  rect 2x2 hole 1.3: 1(-2.5,3.4)
  round 2 hole 1.3: 2(2.5,1.7) 3(-2.5,0) 4(2.5,-1.7) 5(-2.5,-3.4)
TSSOP-14_L5.0-W4.4-P0.65-LS6.4-BL
  rect 0.4x1.7 smd: 1(-1.95,-2.8) 2(-1.3,-2.8) 3(-0.65,-2.8) 4(0,-2.8) 5(0.65,-2.8) 6(1.3,-2.8) 7(1.95,-2.8) 8(1.95,2.8) 9(1.3,2.8) 10(0.65,2.8) 11(0,2.8) 12(-0.65,2.8) 13(-1.3,2.8) 14(-1.95,2.8)

## Nets
As in the schematic.

Pads without a net: P1 6; U5 4; U7 6; U9 MISO T_CLK T_CS T_DIN T_DO T_IRQ; U10 EN GPIO0 GPIO2 GPIO4 GPIO5 GPIO6 GPIO7 GPIO8 GPIO9 GPIO10 GPIO11 GPIO12 GPIO13 GPIO14 GPIO15 GPIO16 GPIO17 GPIO32 GPIO33 GPIO34 GPIO35 GPIO36 GPIO39 RX TX; U11 5 6 7

## Via types
v1: diameter 0.61, hole 0.305, Top Layer to Bottom Layer, 42 vias

## Routing (per net, layer and track width the routed paths; a pad name or vN(x,y) marks a point on that pad's centre or on a via; arc(x,y) is an arc through that point)
+3.3V: length 270.8
  Top Layer w0.5: U7.5 20.18,46.6 20.95,45.82 23.45,45.82 23.85,46.22 23.85,47.34 R4.2 ; C8.1 C9.1
  Top Layer w0.6: 78.49,46.1 78.49,41.41 U9.VCC 76.7,38.61 77.62,37.69 77.62,21.63 77.2,21.21 76.07,21.21 U9.LED
  Top Layer w0.8: H1.8 5.41,77.96 v1(5.45,77.92) ; v1(41.82,67.52) 44.95,67.52 45.65,68.22 C3.1 45.65,75.12 ; v1(23.84,50.98) 23.84,52.08 23.75,52.18 24.75,52.18 25.13,52.56 25.13,55.1 24.23,56 21.65,56 21.65,57.9 20.89,58.66 ; 20.89,58.66 R3.2 ; 20.89,58.66 v1(22.86,58.66) ; C9.1 C7.1 ; C7.1 28.11,63.88 v1(29.15,64.92) 26.45,64.92 25.49,65.89 25.49,67.02 ; C7.1 v1(26.47,62.56) ; 38.65,67.97 R12.2 36.45,67.12 v1(34.25,64.92) ; C8.1 26.71,58.62 v1(26.71,58.69) ; 78.49,46.1 78.41,46.1 76.6,47.91 76.6,91.21 74.2,93.61 54.7,93.61 53.7,92.61 53.7,77.91 51.21,75.42 C10.1 ; v1(39.9,67.52) 39.1,67.52 R13.2 ; R4.2 v1(23.84,48.75)
  Bottom Layer w0.8: v1(39.9,67.52) v1(41.82,67.52) ; v1(26.47,62.56) 20.81,62.56 v1(5.45,77.92) ; v1(23.84,48.75) v1(23.84,50.98) ; C10.1 51.21,75.42 53.8,78.01 53.8,92.31 54.7,93.21 63.8,93.21 66.93,96.34 P1.1 ; v1(22.86,58.66) 26.67,58.66 v1(26.71,58.69) ; v1(29.15,64.92) v1(34.25,64.92)
+5V: length 134.7
  Top Layer w0.5: 27.69,67.3 27.64,67.35
  Top Layer w0.8: C2.1 29.63,67.3 U5.1 ; 27.64,67.35 26.99,67.35 26.66,67.68 26.66,68.73 26.95,69.01 26.95,69.42 27.17,69.2 U5.3
  Top Layer w1: 78.49,91.82 74.64,95.67 U4.1 53.06,95.67 51.8,94.41 51.8,84.27 48.25,80.72 45.45,80.72 42.66,83.51 30.8,83.51 26.95,79.66 26.95,69.42 ; U11.8 34.45,72.13 C2.1
  Bottom Layer w1.2: U4.1 55.33,95.63 51.56,95.63 44.83,102.36 27.94,102.36 27.31,101.73 C1.1 25.87,100.54 U3.4
GND: length 403.5
  Top Layer w0.254: 11.41,56.28 10.94,55.82 3.55,55.82 2.55,54.82 2.55,50.22 4.45,48.32 9.85,48.32 10.97,49.44 10.97,50.82 11.22,51.08 C6.2 ; v1(17.55,58.22) v1(17.55,57.42)
  Top Layer w0.3: C6.2 16.9,51.08 U7.1 ; 14.64,63.44 14.54,63.34 v1(12.87,63.34) 11.93,63.34 11.41,62.82 11.41,56.28 C5.2
  Top Layer w0.4: 11.41,62.82 10.21,64.01 2.5,64.01 ; U7.14 17.58,57.39 v1(17.55,57.42) ; v1(24.92,57.75) 21.65,61.02 v1(17.55,61.02) ; C8.2 30.11,55.78 v1(29.75,55.42) ; v1(15.04,63.84) 14.64,63.44
  Top Layer w0.5: U5.2 29.18,68.25 29.35,68.42 v1(29.35,70.12) ; 55.63,46.1 65.66,36.07 U9.GND
  Top Layer w0.8: U11.4 30.58,78.72 30.57,78.71 29.44,78.71 28.35,77.62 28.35,75.82 29.35,74.82 ; 29.35,74.82 29.75,75.22 35.45,75.22 36.15,74.52 36.15,71.82 C2.2 ; 29.35,74.82 v1(29.35,70.12) ; 38.96,79.29 C12.2 ; 38.96,79.29 38.85,79.18 U12.2 ; 38.96,79.29 C13.1 37.67,80.11 38.23,80.68 40.28,80.68 v1(41.13,79.82) ; C7.2 C9.2 C8.2 ; v1(43.65,78.52) C10.2 C3.2 41.65,70.92 R14.1 ; v1(15.04,63.84) 15.04,64.51 19.46,68.93 R7.1 23.57,68.93 R8.1 23.63,69.5 v1(24.45,70.32)
  Top Layer w1: 2.3,75.31 2.1,75.31 1.3,74.51 1.3,64.91 2.2,64.01 ; 1.4,88.11 2.67,89.38 3.33,89.38 ; 3.33,89.38 U13.1 ; 3.33,89.38 1.7,91.01 1.7,95.81 U8.2 ; H1.7 2.49,75.42 1.3,76.61 1.3,87.81
  Bottom Layer w0.4: v1(29.75,55.42) 27.25,55.42 v1(24.92,57.75) ; 69.47,103.34 69.47,103.48 70.3,104.31 80.8,104.31 81.4,103.71 81.4,81.61 78.91,79.12 78.49,79.12 ; v1(17.55,61.02) 15.01,63.56 15.01,63.81
  Bottom Layer w0.5: v1(12.87,63.34) 12.87,62.9 v1(17.55,58.22) ; D1.2 53.23,93.44 54,94.21 62,94.21 64.2,96.41 64.2,102.46 65.95,104.21 68.6,104.21 69.47,103.34 P1.2
  Bottom Layer w0.7: C3.2 44.96,67.61 56.9,67.61 57.7,66.81 57.7,62.61 56.53,61.44 54.33,61.44 53.5,60.61 53.5,48.33 55.63,46.2 55.63,46.1
  Bottom Layer w0.8: v1(29.35,70.12) 29.15,70.32 v1(24.45,70.32)
  Bottom Layer w1: D1.2 49.53,82.5 45.55,78.52 v1(43.65,78.52) 42.35,79.82 v1(41.13,79.82)
  Bottom Layer w2: U8.2 14.1,98.04 14.61,97.54 U3.3 U3.5 25.95,95.54 C1.2 30.95,100.54 U2.2 46.05,94.25 46.1,94.25 46.81,93.54 46.81,93.49 46.85,93.44 D1.2
$1N404: length 53.1
  Top Layer w0.8: R11.2 11,95.34 U3.1
  Bottom Layer w1.2: U8.1 2.67,100.58 1.52,99.44 1.52,96.52 2.5,95.54 U3.1 11.2,94.84 12.95,93.09 37.3,93.09 U2.1
$1N698: length 46.4
  Bottom Layer w1: U3.2 12.91,102.06 13.84,103 25.78,103 27.05,104.27 47.4,104.27 D1.1 51,100.67 U4.2
$1N1786: length 16.8
  Top Layer w0.254: R2.1 10.14,50.92 10.85,51.62 12.35,51.62 12.65,51.92 17.75,51.92 18.23,51.44 U7.2
  Top Layer w0.5: R2.1 4.83,50.27 U6.2
$1N1792: length 13.8
  Top Layer w0.3: C4.1 18.27,47.48 19.54,48.75 19.54,50.38 U7.4 19.53,50.41 19.53,51.55 18.56,52.52 C5.1 14.29,52.56 R1.2
$1N2031: length 11.1
  Top Layer w0.3: 15.49,48.25 14.45,49.29 C6.1 14.42,50.27 R2.2 ; 15.49,48.25 15.86,48.62 18.53,48.62 18.91,49 18.91,50.37 U7.3 ; 15.49,48.25 C4.2
$1N3106: length 19.6
  Top Layer w0.254: U7.13 18.23,54.72 17.97,54.47 17.25,54.47 13.75,57.97 v1(13.62,57.97)
  Bottom Layer w0.3: v1(13.62,57.97) 8.87,62.72 H1.2
$1N3112: length 108
  Top Layer w0.3: U7.12 18.88,58.57 R3.1 18.49,58.66 v1(17.31,59.83) 16.65,60.5 16.65,62.12 16.93,62.41 21.27,62.41 26.05,57.62 26.05,51.66 29.07,48.64 55.63,48.64
  Bottom Layer w0.3: v1(17.31,59.83) 9.34,67.8 3.41,67.8
  Bottom Layer w0.4: 55.63,48.64 57.1,47.17 57.1,37.31 68.5,25.91 U9.MOSI
$1N3116: length 97.1
  Top Layer w0.3: U7.11 19.53,55.99 19.53,54.97 18.65,54.08 16.61,54.08 12.8,57.89 v1(12.8,59.67) 16.25,63.12 21.15,63.12 26.55,57.72 26.55,51.86 28.5,49.91 57.1,49.91 58.6,51.41 58.6,62.01 56.73,63.88 55.63,63.88 ; H1.5 v1(7.33,66.41)
  Bottom Layer w0.3: v1(12.8,59.67) 12.8,60.94 v1(7.33,66.41)
$1N3121: length 155.5
  Top Layer w0.254: H1.6 v1(9.15,67.13)
  Top Layer w0.3: 55.63,66.42 57.69,66.42 59.3,64.81 59.3,50.41 56.3,47.41 29.6,47.41 27.49,49.52 23.2,49.52 22.14,48.46 ; 20.18,54.47 19.03,53.32 16.23,53.32 12.16,57.39 v1(12.16,62.52) ; 20.18,54.47 U7.10 ; 20.18,54.47 20.18,53.32 22.14,51.35 22.14,48.46 ; 22.14,48.46 22.14,47.65 R4.1
  Bottom Layer w0.3: v1(9.15,67.13) 12.16,64.13 v1(12.16,62.52)
  Bottom Layer w0.4: U9.SCK 69.14,23.37 52,40.51 52,62.8 55.63,66.42
$1N3126: length 27.8
  Top Layer w0.254: R5.2 21.46,54.19 20.81,54.84 20.81,55.99 U7.9
  Top Layer w0.3: H1.3 v1(14.2,65.26) ; U7.9 20.83,57.03 20.55,57.3 20,57.3 19.79,57.51 19.79,59.67 v1(19.22,60.24)
  Bottom Layer w0.3: v1(14.2,65.26) 14.81,65.26 19.22,60.85 v1(19.22,60.24)
$1N5751: length 42.1
  Bottom Layer w0.4: U9.CS 74.58,33.53 73.7,34.41 73.7,67.91 77.29,71.5 78.49,71.5
$1N5766: length 39
  Bottom Layer w0.4: 78.49,66.42 79.39,66.42 80.8,65.01 80.8,36.1 U9.RESET
$1N5777: length 45
  Bottom Layer w0.4: U9.DC 81.5,34.26 81.5,67.41 79.95,68.96 78.49,68.96
$1N6508: length 3
  Top Layer w0.4: R6.1 34.45,79.65 U11.1
$1N6563: length 28.6
  Top Layer w0.8: v1(29.45,76.62) 31.25,76.62 31.91,77.29 U11.3 ; R8.2 23.57,67.42 R7.2 v1(20.25,67.42) ; Q2.3 24.49,80.12 25.91,78.7 v1(25.91,76.62)
  Bottom Layer w0.8: v1(20.25,67.42) 19.95,67.73 19.95,70.66 v1(25.91,76.62) v1(29.45,76.62)
$1N6609: length 30.3
  Top Layer w0.8: R10.1 20.19,84.36 20.19,78.62 12.22,78.62 U13.2
$1N6614: length 2.9
  Top Layer w0.8: R9.1 R10.2
$1N6619: length 2.8
  Top Layer w0.8: R11.1 R9.2
$1N7236: length 95.3
  Top Layer w0.3: U12.5 38.85,75.42 39.06,75.63 39.96,75.63 42.35,78.02 42.35,78.92 43.35,79.92 v1(43.35,80.62) ; P1.3 72.01,98.87 70.5,97.36 49.95,97.36 47.1,94.51 47.1,84.51 v1(45.44,82.85)
  Top Layer w0.5: U12.5 38.75,74.67 R13.1 39.9,69.38 40.65,68.62 40.65,64.32 44.96,60.01 57,60.01 57.8,59.21 57.8,51.91 57.45,51.56 56,51.56 55.63,51.18
  Bottom Layer w0.3: v1(45.44,82.85) 45.44,82.71 v1(43.35,80.62)
$1N7241: length 95
  Top Layer w0.3: P1.4 72.98,104.31 55.9,104.31 44.76,93.17 v1(44.76,83.54) ; v1(42.45,80.83) 42.45,79.62 41.75,78.92 41.75,78.11 39.76,76.12 38.45,76.12 37.9,75.57 U12.4
  Top Layer w0.5: U12.4 37.9,70.93 R12.1 32.95,65.98 32.95,63.42 37.57,58.8 55.63,58.8
  Bottom Layer w0.3: v1(44.76,83.54) 44.76,83.14 v1(42.45,80.83)
$1N7320: length 59.6
  Top Layer w0.3: v1(46,82.05) 48,84.04 48,94.31 50.5,96.81 74.4,96.81 77,99.41 77,102.65 P1.5 ; v1(44.23,80.18) 44.18,80.12 44.15,80.12 42.75,78.72 42.75,77.72 U12.6
  Top Layer w0.8: U12.6 40.61,73.96 R14.2
  Bottom Layer w0.3: v1(46,82.05) 46,81.95 v1(44.23,80.18)
$1N7324: length 2.3
  Top Layer w0.5: C13.2 36.83,78.54 U12.3
$1N7489: length 10.4
  Top Layer w0.3: U11.2 33.18,77.69 34.25,76.62 37.47,76.62 37.47,76.62 39.27,76.62 39.8,77.14 U12.1
  Top Layer w0.5: U12.1 39.82,77.49 39.82,79.21
$1N7539: length 32.2
  Top Layer w0.3: U7.7 21.48,49.35 20.89,48.76 v1(20.88,48.76) ; H1.1 2.39,59.16 v1(2.39,57.81)
  Bottom Layer w0.3: v1(20.88,48.76) 20.24,48.12 3.95,48.12 2.39,49.68 v1(2.39,57.81)
$1N8835: length 6.8
  Top Layer w0.5: R1.1 8.01,54.56 U6.1
$1N10153: length 13.9
  Top Layer w0.8: Q2.1 22.91,75.02 v1(22.9,75.01) ; R6.2 v1(30.55,81.12)
  Bottom Layer w0.8: v1(22.9,75.01) 25.8,77.91 27.34,77.91 v1(30.55,81.12)

## Copper pours and planes (outline as drawn; the poured copper is in the pictures)
GND on Top Layer: 82.55,105.41 61.8,105.41 61.6,105.61 61.6,95.03 62,94.63 61.58,94.21 54,94.21 52.8,93.01 52.8,44.71 0.2,44.71 0.1,44.61 0.1,0 82.41,0 82.5,-0.09 82.55,-0.04
GND on Top Layer: -0.3,44.1 1.8,44.1 1.8,46.47 -0.3,48.57
GND on Top Layer: 56.13,105.41 56.13,94.21 54.3,94.21 50.7,90.61 50.7,50.11 46.9,46.31 0,46.31 0,105.41
GND on Bottom Layer: 0,105.41 82.55,105.41 82.55,0 0,0
(no net) on Top Layer: 17.7,82.61 25,82.61 25,74.31 17.7,74.31
